# Altium schematic sheet OMODRI_BiSSEnc.SchDoc
size A3; Date: Not shown in title block; ApprovedBy: Not shown in title block; CheckedBy: Not shown in title block; Author: Not shown in title block; CompanyName: Not shown in title block; Engineer: Not shown in title block; Organization: Not shown in title block; Address1: Not shown in title block; Address2: Not shown in title block; Address3: Not shown in title block; Address4: Not shown in title block; DocumentNumber: 1; Revision: Use project parameter SCH_Rev; SheetNumber: 3; SheetTotal: 4; PageSetup: Record=PageOptions|CenterHorizontal=True|CenterVertical=True|PrintScale=1.00|XCorrection=1.00|YCorrection=1.00|PrintKind=0|BorderSize=5000000|LeftOffset=0|BottomOffset=0|Orientation=2|PaperLength=1000|PaperWidth=1000|Scale=100|PaperSource=15|PrintQuality=600|MediaType=1|DitherType=10|PaperKind=Letter|PrintScaleMode=1; CurrentTime: Not shown in title block; CurrentDate: Not shown in title block; Time: Not shown in title block; DocumentFullPathAndName: Not shown in title block; DocumentName: Not shown in title block; ModifiedDate: Not shown in title block; ImagePath: Not shown in title block
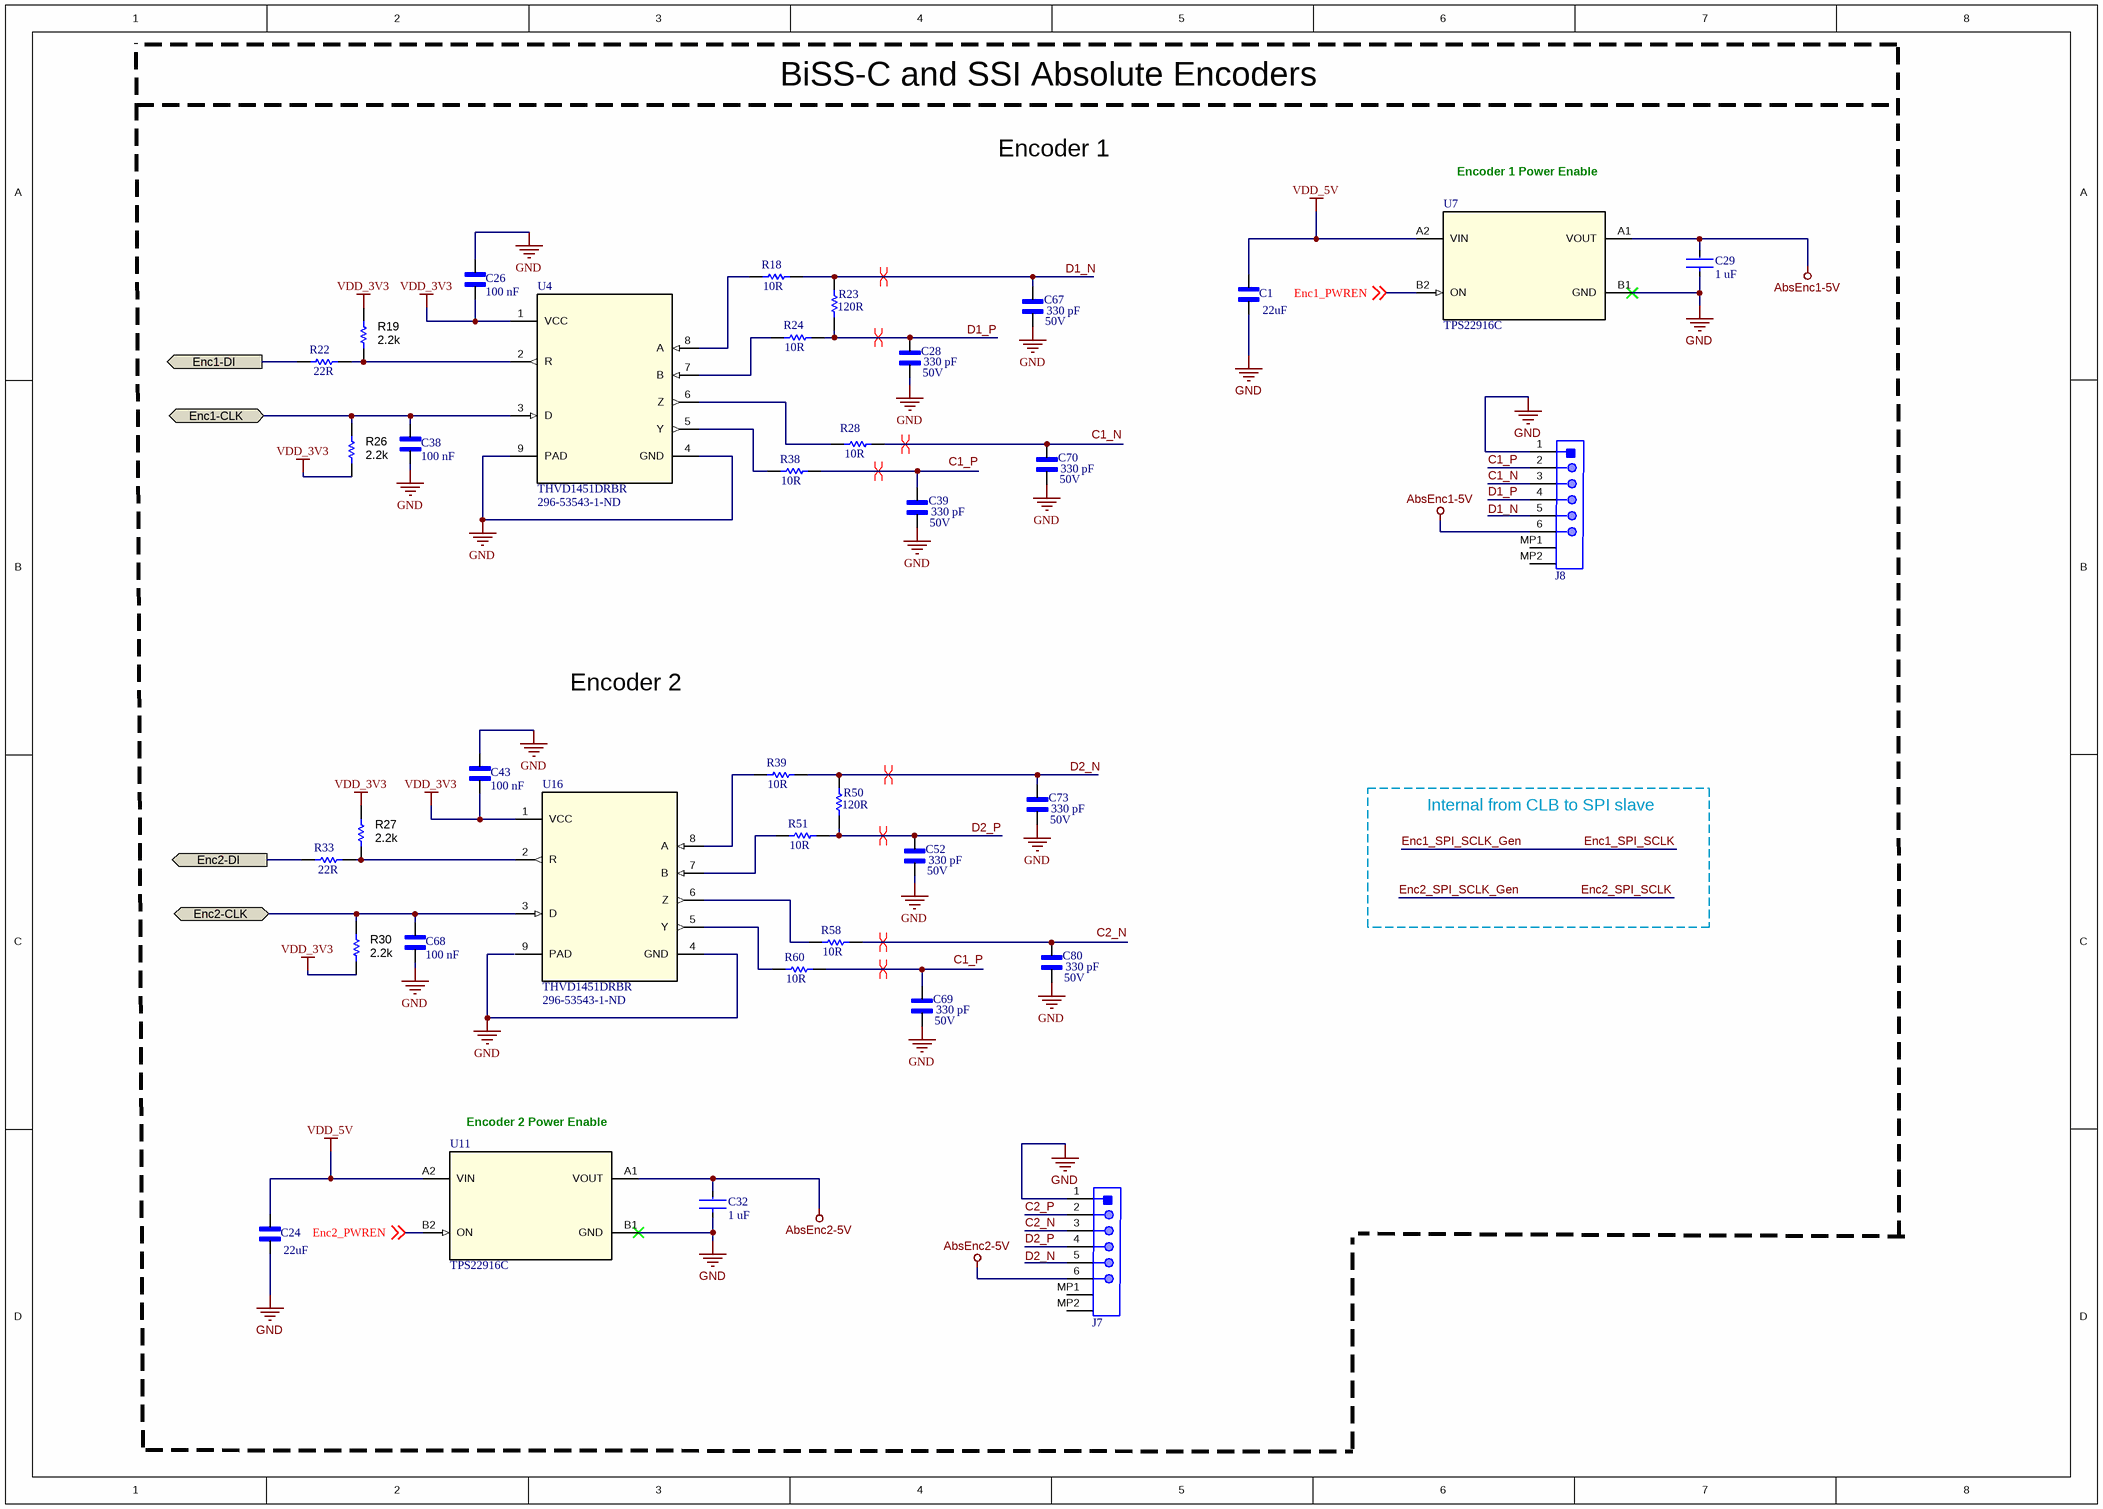
[diagram p0: OMODRI_BiSSEnc.SchDoc]

## Parts
C1  value 22uF  [CAPC1005X55N]  (hidden comment: CL05A226MQ5N6J8)
C24  value 22uF  [CAPC1005X55N]  (hidden comment: CL05A226MQ5N6J8)
C26  value 100 nF  [CAPC0603X33N]  (hidden comment: GRM033R61E104KE14D)
C28  value 330 pF  Voltage: 50V  [CAPC0603X33N]  (hidden comment: GRM033R71H331KA12D)
C29  value 1 uF  [FP-CC0201-BA-MFG]  (hidden comment: CC0201MRX5R5BB105)
C32  value 1 uF  [FP-CC0201-BA-MFG]  (hidden comment: CC0201MRX5R5BB105)
C38  value 100 nF  [CAPC0603X33N]  (hidden comment: GRM033R61E104KE14D)
C39  value 330 pF  Voltage: 50V  [CAPC0603X33N]  (hidden comment: GRM033R71H331KA12D)
C43  value 100 nF  [CAPC0603X33N]  (hidden comment: GRM033R61E104KE14D)
C52  value 330 pF  Voltage: 50V  [CAPC0603X33N]  (hidden comment: GRM033R71H331KA12D)
C67  value 330 pF  Voltage: 50V  [CAPC0603X33N]  (hidden comment: GRM033R71H331KA12D)
C68  value 100 nF  [CAPC0603X33N]  (hidden comment: GRM033R61E104KE14D)
C69  value 330 pF  Voltage: 50V  [CAPC0603X33N]  (hidden comment: GRM033R71H331KA12D)
C70  value 330 pF  Voltage: 50V  [CAPC0603X33N]  (hidden comment: GRM033R71H331KA12D)
C73  value 330 pF  Voltage: 50V  [CAPC0603X33N]  (hidden comment: GRM033R71H331KA12D)
C80  value 330 pF  Voltage: 50V  [CAPC0603X33N]  (hidden comment: GRM033R71H331KA12D)
J7  Conn_JST_BM06B-GHS-TBT_LF_SN_N_eec  [JST_BM06B-GHS-TBT_LF_SN_N_0]  (value not drawn)
J8  Conn_JST_BM06B-GHS-TBT_LF_SN_N_eec  [JST_BM06B-GHS-TBT_LF_SN_N_0]  (value not drawn)
R18  Resistance: 10R  [RESC1005X40X25ML05T10]  (hidden comment: CRCW040210R0FKEDHP)
R19  ValueDisplayed: 2.2k  [0402]  (hidden comment: CRCW04022K20JNED)
R22  value 22R  [RESC1005X40X25ML05T05]  (hidden comment: ERJ-2GEJ220X)
R23  Resistance: 120R  [RESC1005X40X25ML05T10]  (hidden comment: CRCW0402120RJNEDHP)
R24  Resistance: 10R  [RESC1005X40X25ML05T10]  (hidden comment: CRCW040210R0FKEDHP)
R26  ValueDisplayed: 2.2k  [0402]  (hidden comment: CRCW04022K20JNED)
R27  ValueDisplayed: 2.2k  [0402]  (hidden comment: CRCW04022K20JNED)
R28  Resistance: 10R  [RESC1005X40X25ML05T10]  (hidden comment: CRCW040210R0FKEDHP)
R30  ValueDisplayed: 2.2k  [0402]  (hidden comment: CRCW04022K20JNED)
R33  value 22R  [RESC1005X40X25ML05T05]  (hidden comment: ERJ-2GEJ220X)
R38  Resistance: 10R  [RESC1005X40X25ML05T10]  (hidden comment: CRCW040210R0FKEDHP)
R39  Resistance: 10R  [RESC1005X40X25ML05T10]  (hidden comment: CRCW040210R0FKEDHP)
R50  Resistance: 120R  [RESC1005X40X25ML05T10]  (hidden comment: CRCW0402120RJNEDHP)
R51  Resistance: 10R  [RESC1005X40X25ML05T10]  (hidden comment: CRCW040210R0FKEDHP)
R58  Resistance: 10R  [RESC1005X40X25ML05T10]  (hidden comment: CRCW040210R0FKEDHP)
R60  Resistance: 10R  [RESC1005X40X25ML05T10]  (hidden comment: CRCW040210R0FKEDHP)
U4  THVD1451DRBR  Supplier Part Number 1: 296-53543-1-ND  [DRB0008F]
U7  TPS22916C  [YFP0004ABAB]
U11  TPS22916C  [YFP0004ABAB]
U16  THVD1451DRBR  Supplier Part Number 1: 296-53543-1-ND  [DRB0008F]

## Ports
Enc1-CLK (bidir), Enc1-DI (out), Enc2-CLK (bidir), Enc2-DI (out)

## Nets
AbsEnc1-5V: C29.2 J8.6 U7.A1(VOUT)
AbsEnc2-5V: C32.2 J7.6 U11.A1(VOUT)
GND: C1.1 C24.1 C26.2 C28.1 C29.1 C32.1 C38.1 C39.1 C43.2 C52.1 C67.1 C68.1 C69.1 C70.1 C73.1 C80.1 J7.1 J8.1 U4.4(GND) U7.B1(GND) U11.B1(GND) U16.4(GND)
VDD_3V3: C26.1 C43.1 R19.2 R26.1 R27.2 R30.1 U4.1(VCC) U16.1(VCC)
VDD_5V: C1.2 C24.2 U7.A2(VIN) U11.A2(VIN)
C1_N: J8.3
C1_P: J8.2
C2_N: J7.3
C2_P: J7.2
D1_N: C67.2 R18.2 R23.2
D1_P: C28.2 J8.4 R23.1 R24.2
D2_N: C73.2 R39.2 R50.2
D2_P: C52.2 J7.4 R50.1 R51.2
Enc1-CLK: C38.2 R26.2 U4.3(D) ; port Enc1-CLK
Enc1-DI: R22.1 ; port Enc1-DI
Enc1_PWREN: U7.B2(ON) ; off-sheet Enc1_PWREN
Enc2-CLK: C68.2 R30.2 U16.3(D) ; port Enc2-CLK
Enc2-DI: R33.1 ; port Enc2-DI
Enc2_PWREN: U11.B2(ON) ; off-sheet Enc2_PWREN
NetC39_2: C39.2 R38.2
NetC69_2: C69.2 R60.2
NetC70_2: C70.2 R28.2
NetC80_2: C80.2 R58.2
NetR18_1: R18.1 U4.8(A)
NetR19_1: R19.1 R22.2 U4.2(R)
NetR24_1: R24.1 U4.7(B)
NetR27_1: R27.1 R33.2 U16.2(R)
NetR28_1: R28.1 U4.6(Z)
NetR38_1: R38.1 U4.5(Y)
NetR39_1: R39.1 U16.8(A)
NetR51_1: R51.1 U16.7(B)
NetR58_1: R58.1 U16.6(Z)
NetR60_1: R60.1 U16.5(Y)

Not connected (* = marked no-connect by the designer): J7 5 MP1 MP2; J8 5 MP1 MP2; U4 9(PAD); U16 9(PAD)

## Layout directives
differential pair: D1_N, D1_P, D2_N, D2_P, NetC39_2, NetC69_2, NetC70_2, NetC80_2

## Notes on the sheet
- BiSS-C and SSI Absolute Encoders
- Encoder 1
- Encoder 1 Power Enable
- Encoder 2
- Internal from CLB to SPI slave
- (near U11) Encoder 2 Power Enable
- Labels drawn without touching a wire or pin: C1_N, C1_P, C2_N, D1_N, D2_N
- Drawn By:
- SVN Rev:
- Number:
- TID #:
- Orderable:
- Rev:
- Sheet Title:
- File:
- Project Title:
- Designed for:
- Assembly Variant:
- Mod. Date:
- Sheet:
- Size:
- of
- B
- http://www.ti.com
- Texas Instruments and/or its licensors do not warrant the accuracy or completeness of this specification or any information contained therein. Texas Instruments and/or its licensors do not warrant that this design will meet the specifications, will be suitable for your application or fit for any particular purpose, or will operate in an implementation. Texas Instruments and/or its licensors do not warrant that the design is production worthy. You should completely validate and test your design implementation to confirm the system functionality for your application.
- Engineer:
- Contact:
- © Texas Instruments

## Library data of the parts
C1 C24 = CL05A226MQ5N6J8: 22µF ±20% 6.3V Ceramic Capacitor X5R 0402 (1005 Metric); MF: Samsung Electro-Mechanics; Package: 0402 Samsung Electro-Mechanics; Availability: Unavailable; MP: CL05A226MQ5N6J8; DigiKey-Purchase-URL: https://snapeda.com/shop?store=DigiKey&id=3601912; SnapEDA_Link: https://www.snapeda.com/parts/CL05A226MQ5N6J8/Samsung%20Electro-Mechanics/view-part/3601912/?ref=snap; Price: None
C26 C38 C43 C68 = GRM033R61E104KE14D: SMD Capacitor X5R_EIA_ with Capacitance: 0.10uF Tol. 10%. Rated Voltage: 25Vdc; MF: Murata; SnapEDA_Link: https://www.snapeda.com/parts/GRM033R61E104KE14D/Murata/view-part/4375622/?ref=snap; Availability: Unavailable; MP: GRM033R61E104KE14D; Package: 0603 Taiyo Yuden; Price: None
C28 C39 C52 C67 C69 C70 C73 C80 = GRM033R71H331KA12D: SMD Capacitor X7R_EIA_ with Capacitance: 330pF Tol. 10%. Rated Voltage: 50Vdc; MF: Murata; MP: GRM033R71H331KA12D; SnapEDA_Link: https://www.snapeda.com/parts/GRM033R71H331KA12D/Murata/view-part/1976079/?ref=snap; Digi-Key_Purchase_URL: https://www.digikey.com/product-detail/en/murata-electronics/GRM033R71H331KA12D/490-17085-1-ND/7602084?utm_source=snapeda&utm_medium=aggregator&utm_campaign=symbol; Digi-Key_Part_Number: 490-17085-1-ND; Package: 0603 Taiyo Yuden
C29 C32 = CMP-03422-000660-1: CAP CER 1UF 6.3V X5R 0201; Manufacturer: Yageo; Material: Ceramic; Tolerance: 0.2; Temperature Coefficient: 15%; Lead Free: Yes; Capacitance: 1 uF; ComponentLink2URL: http://www.yageo.com/documents/recent/UPY-GPHC_X5R_4V-to-50V_25.pdf; Footprint Url: http://www.yageo.com/exep/pages/download/literatures/UPY-C_GEN_24.pdf; Temperature Range Low: -55°C; Category: Cap; Device Class L3: Ceramic Capacitors; Device Class L2: Capacitors; Digikey Description: CAP CER 1UF 6.3V X5R 0201; Automotive: No; Temperature: -55°C to +85°C; RoHS: TRUE; Octopart: https://octopart.com/cc0201mrx5r5bb105-yageo-33242268; Height: 0.33mm; Temperature Range High: +85°C; Temperature Characteristic: X5R; Device Class L1: Passive Components; Package: CC0201-BA; ComponentLink2Description: Datasheet; Manufacturer Part Number: CC0201MRX5R5BB105; Voltage Rating: 6.3 V; Mouser Description: Multilayer Ceramic Capacitors MLCC - SMD/SMT 1.0uF 6.3V X5R 20%; Ipc Land Pattern Name: CAPC6030X30
J7 J8 = Conn_JST_BM06B-GHS-TBT_LF_SN_N_eec: CONN HEADER GH TOP 6POS 1.25MM; Manufacturer: JST; Part Number: BM06B-GHS-TBT(LF)(SN)(N); helpURL: https://upverter.com/upn/revision/9caaf2120726c690/; ComponentLink2Description: Datasheet; Temperature: -25°C to +85°C; Package: HDR06; Supplier 2: Mouser; Price: 0.396190066284; Supplier 1: Digi-Key; ComponentLink1URL: https://upverter.com/upn/revision/9caaf2120726c690/; Supplier Part Number 1: 455-1582-1-ND; ComponentLink1Description: Upverter; ComponentLink2URL: http://www.jst-mfg.com/product/pdf/eng/eGH.pdf; RoHS: TRUE; Temperature Range High: +85°C; Digikey Description: CONN HEADER GH TOP 6POS 1.25MM; Digikey Part Number: 455-1582-1-ND; Temperature Range Low: -25°C; Lead Free: yes
R18 R24 R28 R38 R39 R51 R58 R60 = CRCW040210R0FKEDHP: SMD Chip Resistor, 0402 [1005 Metric], 10 ohm, CRCW-HP e3 Series, 50 V, Thick Film, 200 mW; Manufacturer: Vishay Dale; Voltage Rating (DC): 50V; Temperature Coefficient: 100ppm/°C; Tolerance: 1%; Power Rating: 125mW; Part Number: CRCW040210R0FKEDHP; Supplier 1: Digi-Key; Manufacturer Part Number: CRCW040210R0FKEDHP; RoHS: Yes; Category: Chip SMD Resistors; Stock 1: 25822; Pricing 1: 1=0,14000, 10=0,12600, 100=0,04840, 1000=0,02130, 2500=0,01839, 5000=0,01646 (USD); Mount: Surface Mount; Case/Package: 0402; Weight: 2.3E-05oz; Contact Plating: Tin; Case Code (Imperial): 0402; Case Code (Metric): 1005; Min Operating Temperature: -55°C; Max Operating Temperature: 155°C; Packaging: Tape and Reel; Voltage Rating: 50V; Package Quantity: 10000; Termination: SMD/SMT; Composition: Thick Film; Military Standard: Not; Length: 1mm; Height: 0.3mm; Width: 0.5mm; Depth: 0.5mm; Radiation Hardening: No; Lead Free: Lead Free; REACH SVHC: Unknown; ComponentLink1URL: https://datasheet.ciiva.com/5542/crcwhpe3-46056-5542142.pdf?src-supplier=Mouser; ComponentLink1Description: https://datasheet.ciiva.com/5542/crcwhpe3-46056-5542142.pdf?src-supplier=Mouser; Supplier Part Number 1: 541-10.0YCT-ND
R19 R26 R27 R30 = CMP-0026890-5: RES, 2.2 k, 5%, 0.063 W, AEC-Q200 Grade 0, 0402; Manufacturer: Vishay-Dale; Power_W: 63mW; TempCo: 200 ppm/C; Value_Code: 2k20; Value: 2.2k; EIA_Code: E24; SizeX_mm: 1; SizeY_mm: 0.5; SizeZ_mm: 0.6; Value2: 0.063W; AEC Qualified: Y; VDC_V: 50V; AEC Category: Q200; AEC Grade: 0; Supplier Part Number 2: 59M6710; Supplier 2: Newark; Supplier Part Number 3: 71-CRCW0402J-2.2K-E3; Supplier 3: Mouser; RoHS: E; Value1: 5%; MountType: SMT; Supplier 1: Digi-Key; PackageReference: 0402; Tolerance_%: 5%; Res_ohm: 2.2k; SizeArea_mm2: 0.5; CompType: Resistor; PartNumber: CRCW04022K20JNED; ComponentLink1Description: Datasheet link; Supplier Part Number 1: 541-2.2KJCT-ND; Technology: Thick Film; ComponentLink1URL: http://www.vishay.com/docs/20035/dcrcwe3.pdf
R22 R33 = CMP-2002-00486-1: Manufacturer: Panasonic; Part Number: ERJ-2GEJ220X
R23 R50 = CRCW0402120RJNEDHP: RES SMD 120 OHM 5% 1/5W 0402; Manufacturer: Vishay Dale; Power Rating: 125mW; Voltage Rating: 50V; Temperature Coefficient: 200ppm/°C; Part Number: CRCW0402120RJNEDHP; Supplier 1: Digi-Key; Manufacturer Part Number: CRCW0402120RJNEDHP; RoHS: Yes; Category: Chip SMD Resistors; Stock 1: 18750; Pricing 1: 1=0,13000, 10=0,11300, 100=0,04350, 1000=0,01912, 2500=0,01651, 5000=0,01477 (USD); Case/Package: 0402; Weight: 2.3E-05oz; Case Code (Metric): 1005; Case Code (Imperial): 0402; Min Operating Temperature: -55°C; Max Operating Temperature: 155°C; Package Quantity: 1; Tolerance: 5%; Packaging: Tape and Reel; Composition: Thick Film; Max Power Dissipation: 125mW; Features: Automotive AEC-Q200; Number of Terminations: 2; Termination: SMD/SMT; Military Standard: Not; Length: 1mm; Height: 0.016inch; Width: 0.02inch; Depth: 0.5mm; Lead Free: Lead Free; ComponentLink1URL: https://datasheet.ciiva.com/12577/crcwhpe3-46056-12577101.pdf?src-supplier=Mouser; ComponentLink1Description: https://datasheet.ciiva.com/12577/crcwhpe3-46056-12577101.pdf?src-supplier=Mouser; ComponentLink2URL: https://datasheet.ciiva.com/6548/crcwhpe3-6548111.pdf?src-supplier=Digi-Key; ComponentLink2Description: https://datasheet.ciiva.com/6548/crcwhpe3-6548111.pdf?src-supplier=Digi-Key; Supplier Part Number 1: 541-120YACT-ND
U4 U16 = THVD1451DRBR: Single Transmitter/Receiver RS-422/RS-485 8-Pin VSON EP T/R; Manufacturer: Texas Instruments; Simplex/Duplex: Full Duplex; PartNumber: THVD1451DRBR; RefDes: RefDes; TYPE: TYPE; Value: Value; Supplier 1: Digi-Key; Manufacturer Part Number: THVD1451DRBR; RoHS: No; Stock 1: 1028; Pricing 1: 1=2,66000, 10=2,38700, 25=2,25680, 100=1,85560, 250=1,66500, 500=1,60480, 1000=1,33399 (USD); Min Operating Temperature: -40°C; Max Operating Temperature: 125°C
U7 U11 = TPS22916C: TPS22916CY Single-Channel Ultra-Low Leakage Load Switch 2A 60 mO 1V to 5.5V 4-Pin DSBGA T/R; Manufacturer: Texas Instruments; Manufacturer Part Number: TPS22916CYFPR; Number of Channels: 1; Fault Protection: Reverse Current; Output Configuration: High Side; Supplier 1: Digi-Key; RoHS: No; Stock 1: 2282; Pricing 1: 1=0,42000, 10=0,36400, 25=0,33960, 100=0,25220, 250=0,21340, 500=0,20370, 1000=0,15035 (USD); Min Operating Temperature: -40°C; Max Operating Temperature: 85°C; Packaging: Tape and Reel; Number of Outputs: 1; Max Output Current: 2A; ComponentLink1URL: http://www.ti.com/lit/ds/symlink/tps22916.pdf?src-supplier=Digi-Key; ComponentLink1Description: http://www.ti.com/lit/ds/symlink/tps22916.pdf?src-supplier=Digi-Key; Supplier Part Number 1: 296-50065-1-ND